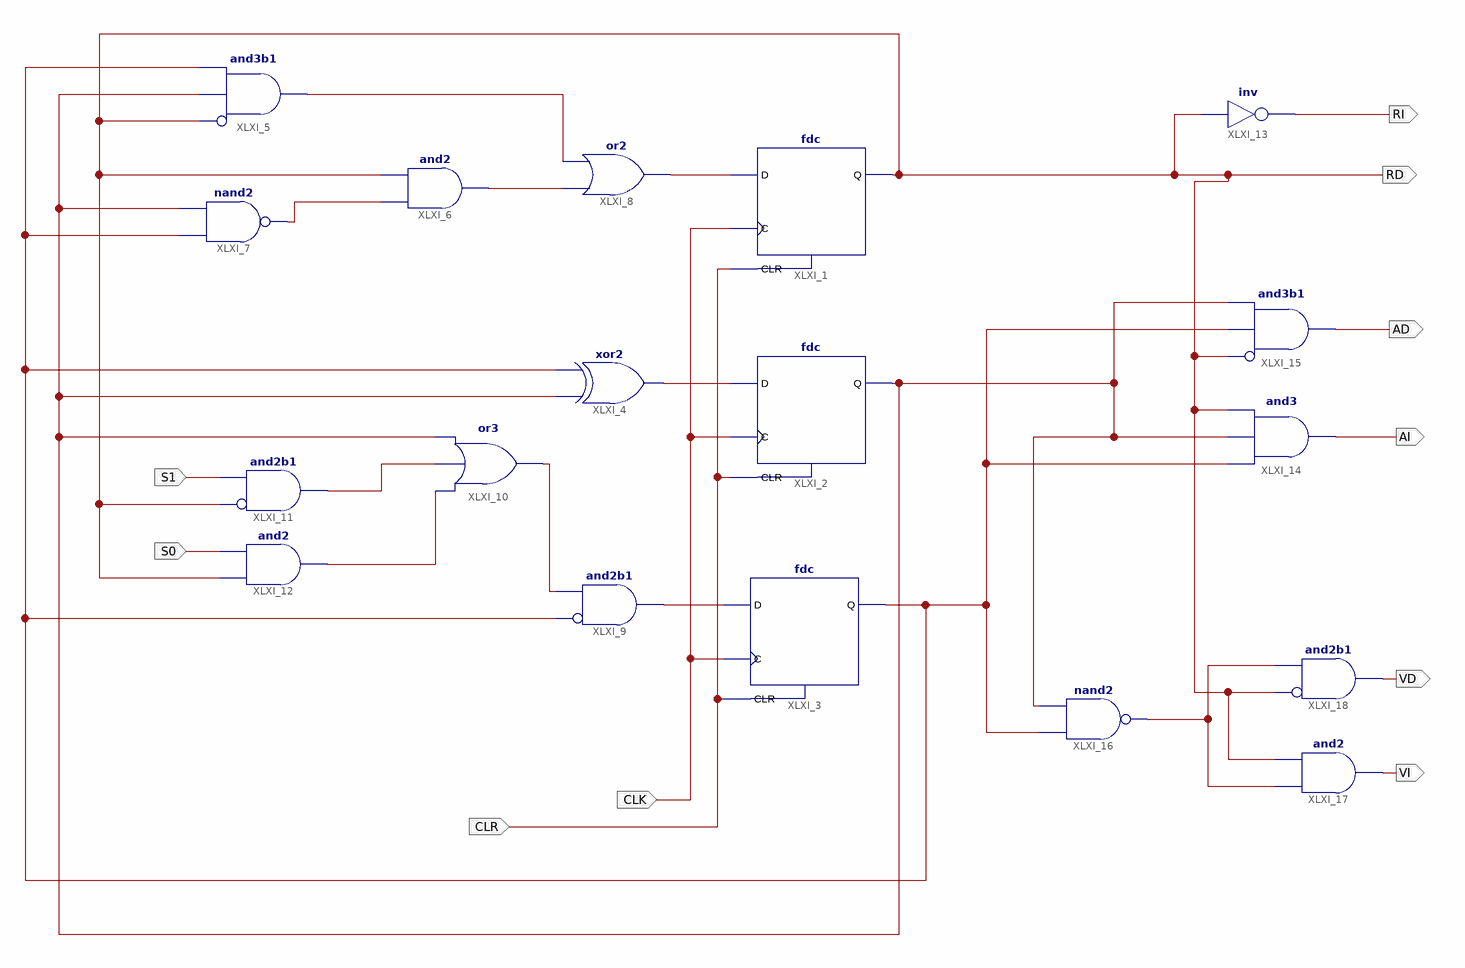
[diagram p0: schematic sheet 1]
// Xilinx ISE schematic p4ej1.sch (spartan3) as structural Verilog: 18 symbols, 10 ports
module p4ej1 (
  input  S0,
  input  S1,
  input  CLK,
  input  CLR,
  output RD,
  output RI,
  output AD,
  output AI,
  output VD,
  output VI
);

  wire XLXN_5, XLXN_6, XLXN_7, XLXN_8, XLXN_9, XLXN_12, XLXN_13, XLXN_15, XLXN_16, XLXN_36, XLXN_39, XLXN_43;

  fdc XLXI_1 (.C(CLK), .CLR(CLR), .D(XLXN_9), .Q(RD));
  fdc XLXI_2 (.C(CLK), .CLR(CLR), .D(XLXN_5), .Q(XLXN_39));
  fdc XLXI_3 (.C(CLK), .CLR(CLR), .D(XLXN_12), .Q(XLXN_36));
  xor XLXI_4 (XLXN_5, XLXN_39, XLXN_36);
  and XLXI_5 (XLXN_7, ~RD, XLXN_39, XLXN_36);  // and3b1
  and XLXI_6 (XLXN_6, XLXN_8, RD);
  nand XLXI_7 (XLXN_8, XLXN_36, XLXN_39);
  or XLXI_8 (XLXN_9, XLXN_6, XLXN_7);
  and XLXI_9 (XLXN_12, ~XLXN_36, XLXN_13);  // and2b1
  or XLXI_10 (XLXN_13, XLXN_16, XLXN_15, XLXN_39);
  and XLXI_11 (XLXN_15, ~RD, S1);  // and2b1
  and XLXI_12 (XLXN_16, RD, S0);
  not XLXI_13 (RI, RD);
  and XLXI_14 (AI, XLXN_36, XLXN_39, RD);
  and XLXI_15 (AD, ~RD, XLXN_36, XLXN_39);  // and3b1
  nand XLXI_16 (XLXN_43, XLXN_36, XLXN_39);
  and XLXI_17 (VI, XLXN_43, RD);
  and XLXI_18 (VD, ~RD, XLXN_43);  // and2b1
endmodule
